# EAGLE design DoubleLineInModuel (EAGLE 7.7.0)
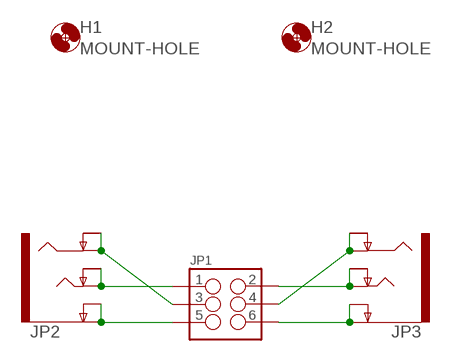
[diagram p0: schematic, sheet 1]

## Parts
H1  MOUNT-HOLE  [3.2-NOMARKINGS-SMALLSAFEZONE]
H2  MOUNT-HOLE  [3.2-NOMARKINGS-SMALLSAFEZONE]
JP1  M03X2  [2X3-SHROUDED]
JP2  AUDIO-JACK4-.25-HORIZ-TRS  [AUDIO-JACK-.25-INCH-HORIZ-PTH]
JP3  AUDIO-JACK4-.25-HORIZ-TRS  [AUDIO-JACK-.25-INCH-HORIZ-PTH]

## Nets
N$1: JP1.1 JP2.P$6(TIP) JP2.P$7(TIP-NORM)
N$2: JP1.3 JP2.P$4(RING) JP2.P$5(RING-NORM)
N$3: JP1.5 JP2.P$2(EARTH) JP2.P$3(EARTH-NORM)
N$4: JP1.6 JP3.P$2(EARTH) JP3.P$3(EARTH-NORM)
N$5: JP1.2 JP3.P$6(TIP) JP3.P$7(TIP-NORM)
N$6: JP1.4 JP3.P$4(RING) JP3.P$5(RING-NORM)

## Library data of the parts
H1 H2 = zephod-components:MOUNT-HOLE: MOUNTING HOLE with drill center marker
JP1 = SparkFun-Connectors:M03X2: 2x3 .1" header. Shrouded, with keying- CONN-10681 SMT- CONN-11415 Pogo pins- HW-11044; PROD_ID: CONN-10681
JP2 JP3 = SparkFun-Connectors:AUDIO-JACK4-.25-HORIZ-TRS: 1/4" TRS jack, horizontal Production SKU: COM-11144 Footprint unproven - datasheet and part seem to be slightly different; PROD_ID: COM-11144

## Net classes
0 default: width 0.508 mm

## Board
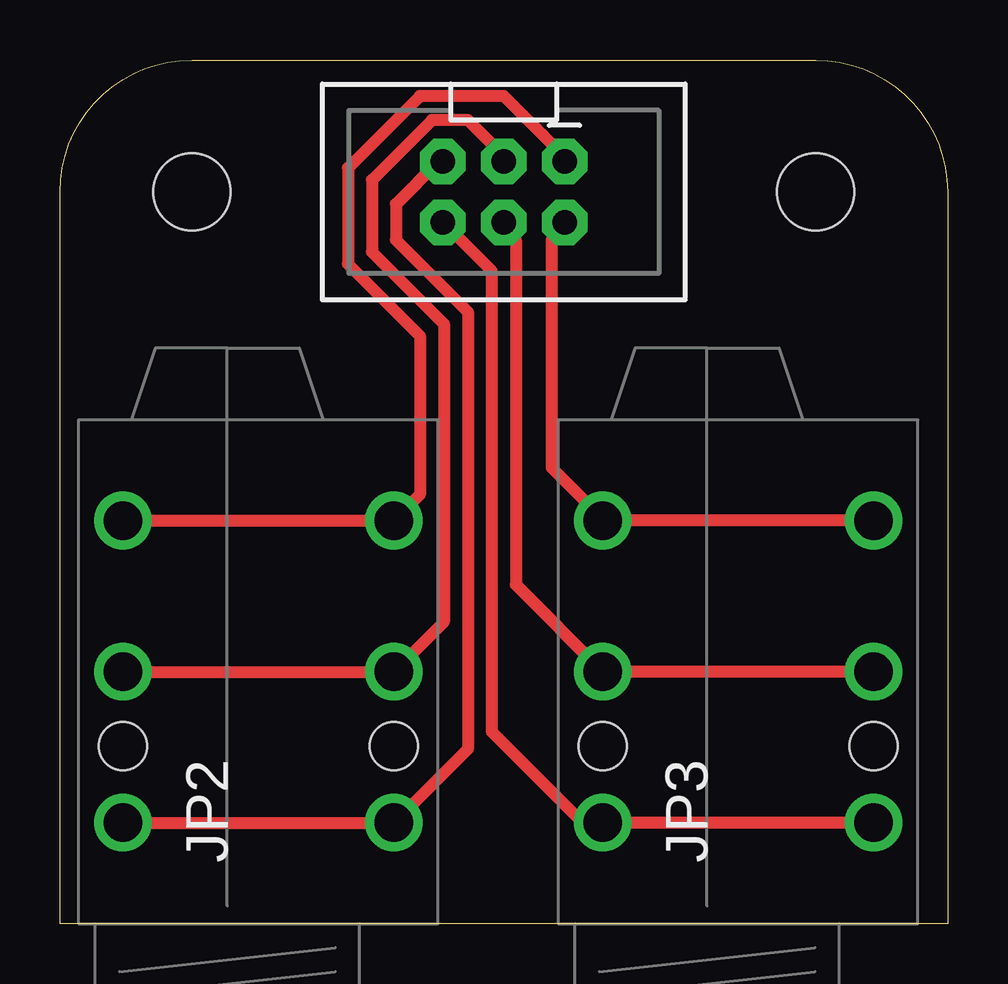
[diagram p1: board, top side]

Size 37 x 36 mm. Coordinates in mm from the lower left corner, seen from the top.
Outline: 0,0 0,30.5 arc-90 5.5,36 31.5,36 arc-90 37,30.5 37,0 0,0
Copper layers (1*16): Top 0.035mm / dielectric 1.5mm / Bottom 0.035mm
Design rules "default": minimum track width 10mil, minimum drill 24mil, track to track 8mil, track to pad 8mil, pad to pad 8mil, via to via 8mil, smd to smd 8mil, copper to edge 40mil, drill to drill 8mil, minimum pad ring 10mil, minimum via ring 8mil, stop-mask expansion 4mil, vias tented up to drill 0mil, thermal gap 10mil

### Footprints (pad centres in the part's own frame; a part is rotated, then mirrored left to right if it is on the bottom)
3.2-NOMARKINGS-SMALLSAFEZONE = hole 3.2: 0,0
2X3-SHROUDED = drill 1.016 pad 1.88 octagon: 1 -1.27,2.54; 2 1.27,2.54; 3 -1.27,0; 4 1.27,0; 5 -1.27,-2.54; 6 1.27,-2.54
AUDIO-JACK-.25-INCH-HORIZ-PTH = drill 1.6: P$2 4.2,-6.92; P$3 4.2,4.38; P$4 10.5,-6.92; P$5 10.5,4.38; P$6 16.8,-6.92; P$7 16.8,4.38 | hole 2: 7.4,4.38; 7.4,-6.92

### Placement (x,y rotation side)
H1  5.5,30.5 0 top
H2  31.5,30.5 0 top
JP1  18.5,30.5 270 top
JP2  7,0 90 top
JP3  27,0 90 top

### Tracks (layer width: path | path; a pad name or v marks a point on that pad's centre or on a via)
N$1
  Top 0.508: JP2.P$7 JP2.P$6 15,17.88 15,24.5 12,27.5 12,31.5 15,34.5 18.5,34.5 21.04,31.96 JP1.1
N$2
  Top 0.508: JP2.P$5 JP2.P$4 16,12.58 16,25 13,28 13,31 15.5,33.5 17,33.5 18.5,32 JP1.3
N$3
  Top 0.508: JP2.P$3 JP2.P$2 17,7.28 17,25.5 14,28.5 14,30 15.77,31.77 JP1.5
N$4
  Top 0.508: JP3.P$2 JP3.P$3 21.8,4.2 18,8 18,27.19 JP1.6
N$5
  Top 0.508: JP3.P$6 JP3.P$7 22.62,16.88 20.5,19 20.5,28.5 21,29.19 JP1.2
N$6
  Top 0.508: JP3.P$4 JP3.P$5 19,14.12 19,28.5 JP1.4